# EAGLE design ESP03 Adapter (EAGLE 7.2.0)
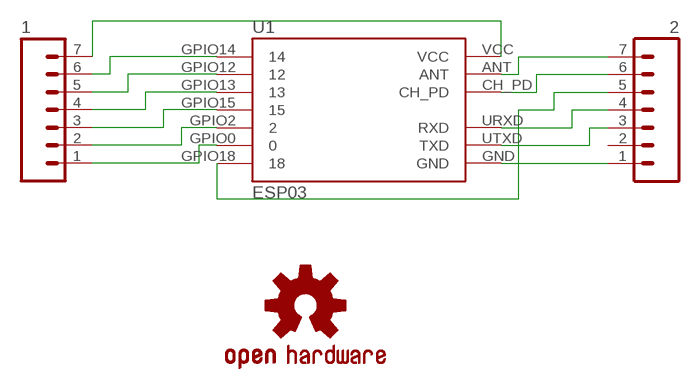
[diagram p0: schematic, sheet 1]

## Parts
1  M07  [1X07]
2  M07  [1X07]
LOGO1  OSHW-LOGOM  [OSHW-LOGO-M]
U1  ESP03  [ESP03]

## Nets
N$1: 1.7 U1.VCC
N$2: 1.6 U1.GPIO14
N$3: 1.5 U1.GPIO12
N$4: 1.4 U1.GPIO13
N$5: 1.3 U1.GPIO15
N$6: 1.2 U1.GPIO2
N$7: 1.1 U1.GPIO0
N$8: 2.7 U1.ANT
N$9: 2.6 U1.CH_PD
N$10: 2.5 U1.GPIO18
N$11: 2.4 U1.URXD(RXD)
N$12: 2.3 U1.UTXD(TXD)
N$13: 2.1 U1.GND
Unconnected: 2.2

## Library data of the parts
1 2 = SparkFun-Connectors:M07: Header 7 Standard 7-pin 0.1" header. Use with straight break away headers (SKU : PRT-00116), right angle break away headers (PRT-00553), swiss pins (PRT-00743), machine pins (PRT-00117), and female headers (PRT-00115). NOTES ON THE VARIANTS LOCK and LOCK_LONGPADS... This footprint was designed to help hold the alignment of a through-hole component (i.e. 7-pin header) while soldering it into place. You may notice that each hole has been shifted either up or down by 0.005 of an inch from it's more standard position (which is usually a perfectly straight line). This slight alteration caused the pins (the squares in the middle) to touch the edges of the holes. Because they are alternating, it causes a "brace" to hold the header in place. 0.005 has proven to be the perfect amount of "off-center" position when using our standard breakaway headers. Although looks a little odd when you look at the bare footprint, once you have a header in there, the alteration is very hard to notice. Also, if you push a header all the way into place, it is covered up entirely on the bottom side. This idea of altering the position of holes to aid alignment will be further integrated into the Sparkfun Library for other footprints. It can help hold any component with 3 or more connection pins.
LOGO1 = SparkFun-Aesthetics:OSHW-LOGO: Open Source Hardware Logo This logo indicates the piece of hardware it is found on incorporates a OSHW license and/or adheres to the definition of open source hardware found here: http://freedomdefined.org/OSHW
U1 = ESP:ESP03: ESP03 Footprint

## Board
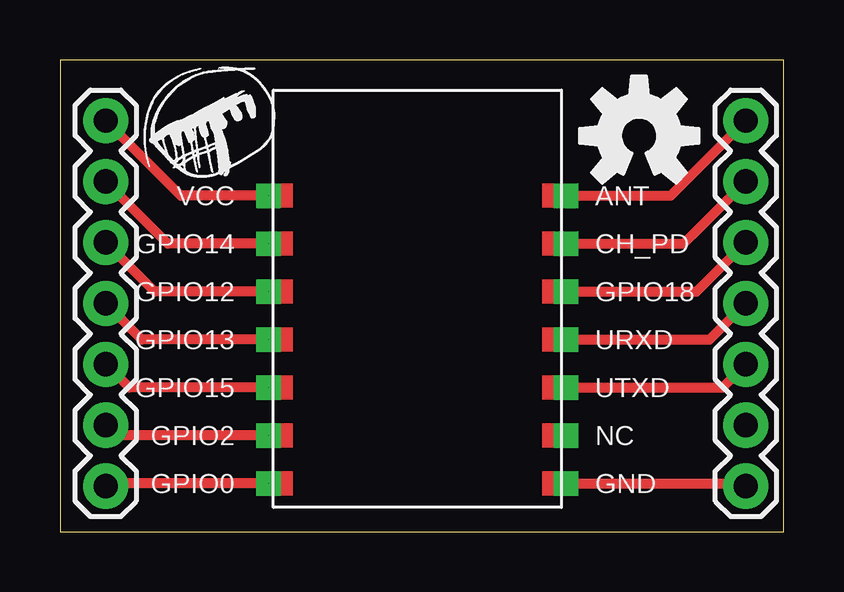
[diagram p1: board, top side]

Size 30.15 x 19.68 mm. Coordinates in mm from the lower left corner, seen from the top.
Outline: 0,0 30.15,0 30.15,19.68 0,19.68 0,0
Copper layers (1*16): Top 0.035mm / dielectric 1.5mm / Bottom 0.035mm
Design rules "default": minimum track width 10mil, minimum drill 24mil, track to track 8mil, track to pad 8mil, pad to pad 8mil, via to via 8mil, smd to smd 8mil, copper to edge 40mil, drill to drill 8mil, minimum pad ring 10mil, minimum via ring 8mil, stop-mask expansion 4mil, vias tented up to drill 0mil, thermal gap 10mil

### Footprints (pad centres in the part's own frame; a part is rotated, then mirrored left to right if it is on the bottom)
1X07 = drill 1.016 pad 1.88: 1 0,0; 2 2.54,0; 3 5.08,0; 4 7.62,0; 5 10.16,0; 6 12.7,0; 7 15.24,0
ESP03 = drill 0.008 pad 1.016 square: ANT 12.2,-4.4; CH_PD 12.2,-6.4; GND 12.2,-16.4; GPIO0 -0.2,-16.4; GPIO2 -0.2,-14.4; GPIO12 -0.2,-8.4; GPIO13 -0.2,-10.4; GPIO14 -0.2,-6.4; GPIO15 -0.2,-12.4; GPIO18 12.2,-8.4; NC 12.2,-14.4; URXD 12.2,-10.4; UTXD 12.2,-12.4; VCC -0.2,-4.4

### Placement (x,y rotation side)
1  1.91,1.91 90 top
2  28.57,1.91 90 top
E$1  [HARK-S]  3.17,14.61 0 top
LOGO1  24.13,16.51 0 top
U1  8.89,18.41 0 top

### Tracks (layer width: path | path; a pad name or v marks a point on that pad's centre or on a via)
N$1
  Top 0.406: U1.VCC 5.04,14.02 1.7
N$2
  Top 0.406: U1.GPIO14 4.5,12.02 1.6
N$3
  Top 0.406: U1.GPIO12 3.96,10.02 1.5
N$4
  Top 0.406: U1.GPIO13 3.42,8.02 1.4
N$5
  Top 0.406: U1.GPIO15 2.88,6.01 1.3
N$6
  Top 0.406: U1.GPIO2 2.33,4.01 1.2
N$7
  Top 0.406: U1.GPIO0 2.02,2.02 1.1
N$8
  Top 0.406: U1.ANT 25.45,14.02 2.7
N$9
  Top 0.406: U1.CH_PD 25.98,12.02 2.6
N$10
  Top 0.406: U1.GPIO18 26.52,10.02 2.5
N$11
  Top 0.406: U1.URXD 27.07,8.02 2.4
N$12
  Top 0.406: U1.UTXD 27.61,6.01 2.3
N$13
  Top 0.406: U1.GND 28.46,2.02 2.1